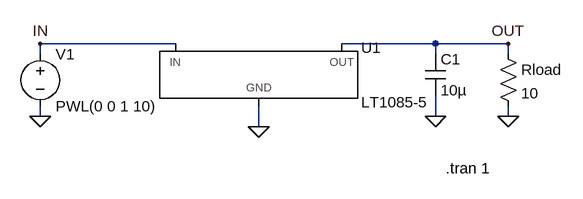
[diagram p0: schematic 1085-5.asc]
1085-5.asc, the LTspice schematic file:
Version 4
SHEET 1 2800 1520
WIRE 1552 896 1344 896
WIRE 1952 896 1808 896
WIRE 2064 896 1952 896
WIRE 1344 912 1344 896
WIRE 1952 912 1952 896
WIRE 2064 912 2064 896
WIRE 1344 1008 1344 992
WIRE 1952 1008 1952 976
WIRE 2064 1008 2064 992
WIRE 1680 1024 1680 992
FLAG 2064 896 OUT
FLAG 2064 1008 0
FLAG 1344 1008 0
FLAG 1952 1008 0
FLAG 1344 896 IN
FLAG 1680 1024 0
SYMBOL VOLTAGE 1344 896 R0
WINDOW 123 0 0 Left 2
SYMATTR InstName V1
SYMATTR Value PWL(0 0 1 10)
SYMATTR SpiceLine Rser=0.1
SYMBOL RES 2048 896 R0
SYMATTR InstName Rload
SYMATTR Value 10
SYMBOL cap 1936 912 R0
SYMATTR InstName C1
SYMATTR Value 10µ
SYMBOL PowerProducts\\LT1085-5 1680 896 R0
SYMATTR InstName U1
TEXT 1968 1088 Left 2 !.tran 1

The netlist it stands for:
* 1085-5.asc
V1 IN 0 PWL(0 0 1 10) Rser=0.1
Rload OUT 0 10
C1 OUT 0 10µ
XU1 0 OUT IN LT1085-5  ; pins GND OUT IN
.tran 1
.backanno
.end